# EAGLE design Nixie_Power_Suppy_v2.0.2 (EAGLE 6.5.0)
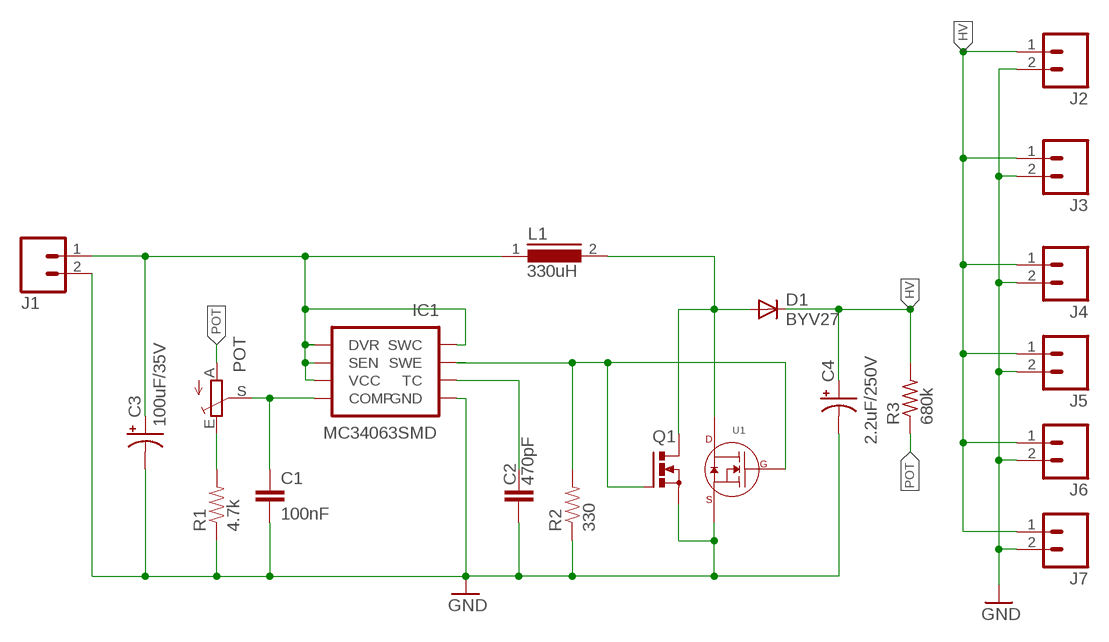
[diagram p0: schematic, sheet 1]

## Parts
C1  100nF  CAP0805  [0805]
C2  470pF  CAP0805  [0805]
C3  100uF/35V  CAP_POLPTH1  [CPOL-RADIAL-100UF-25V]
C4  2.2uF/250V  CAP_POLPTH1  [CPOL-RADIAL-100UF-25V]
D1  BYV27  [SOD57-10]
IC1  MC34063SMD  [SO08]
J1  M02LOCK  [1X02_LOCK]
J2  M02LOCK  [1X02_LOCK]
J3  M02LOCK  [1X02_LOCK]
J4  M02LOCK  [1X02_LOCK]
J5  M02LOCK  [1X02_LOCK]
J6  M02LOCK  [1X02_LOCK]
J7  M02LOCK  [1X02_LOCK]
L1  330uH  DR74  [DR74]
POT  TRIM_EU-CA6V  [CA6V]
Q1  PMOSFET_NTO220BV  [TO220BV]
R1  4.7k  RESISTOR0805-RES  [0805]
R2  330  RESISTOR0805-RES  [0805]
R3  680k  R-US_M1206  [M1206]
U1  MOSFET_N-CHANNEL_SINGLE_TO-252-3  [TO-252-3]

## Nets
GND: C1.2 C2.2 C3.2(-) C4.2(-) IC1.4(GND) J1.2 J2.2 J3.2 J4.2 J5.2 J6.2 J7.2 Q1.S R1.1 R2.1 U1.3(SOURCE)
HV: C4.1(+) D1.C J2.1 J3.1 J4.1 J5.1 J6.1 J7.1 R3.2
N$1: POT.E R1.2
N$2: C1.1 IC1.5(COMP) POT.S
N$3: C3.1(+) IC1.1(SWC) IC1.6(VCC) IC1.7(SEN) IC1.8(DVR) J1.1 L1.1
N$6: D1.A L1.2 Q1.D U1.PAD(DRAIN)
N$8: C2.1 IC1.3(TC)
N$11: IC1.2(SWE) Q1.G R2.2 U1.1(GATE)
POT: POT.A R3.1

## Library data of the parts
C1 C2 = SparkFun-Passives:CAP: Capacitor Standard 0603 ceramic capacitor, and 0.1" leaded capacitor.
C3 C4 = SparkFun-Passives:CAP_POL: Capacitor Polarized These are standard SMD and PTH capacitors. Normally 10uF, 47uF, and 100uF in electrolytic and tantalum varieties. Always verify the external diameter of the through hole cap, it varies with capacity, voltage, and manufacturer. The EIA devices should be standard.
D1 = diode:BYV27: DIODE ultra fast
IC1 = SparkFun-PowerIC:MC34063: Jellybean switching supply controller
J1-J7 = SparkFun-Connectors:M02: Standard 2-pin 0.1" header. Use with - straight break away headers ( PRT-00116) - right angle break away headers (PRT-00553) - swiss pins (PRT-00743) - machine pins (PRT-00117) - female headers (PRT-00115) Molex polarized connector foot print use with: PRT-08233 with associated crimp pins and housings. 2.54_SCREWTERM for use with PRT-10571. 3.5mm Screw Terminal footprints for PRT-08084 5mm Screw Terminal footprints for use with PRT-08432
L1 = inductors:DR74: High Power Density, High Efficiency, Shielded Inductors Source: coiltronics_dr_series.pdf
POT = pot:TRIM_EU-: POTENTIOMETER
Q1 = transistor-power:PMOSFET_N: Power MOSFET N-Channel
R1 R2 = SparkFun-Passives:RESISTOR: Resistor Basic schematic elements and footprints for 0603, 1206, and PTH resistors.
R3 = rcl:R-US_: RESISTOR, American symbol
U1 = PP_Eagle_Part_Discrete_Semi_Conductors:MOSFET_N-CHANNEL_SINGLE: Mosfet - N-Channel - Single

## Board
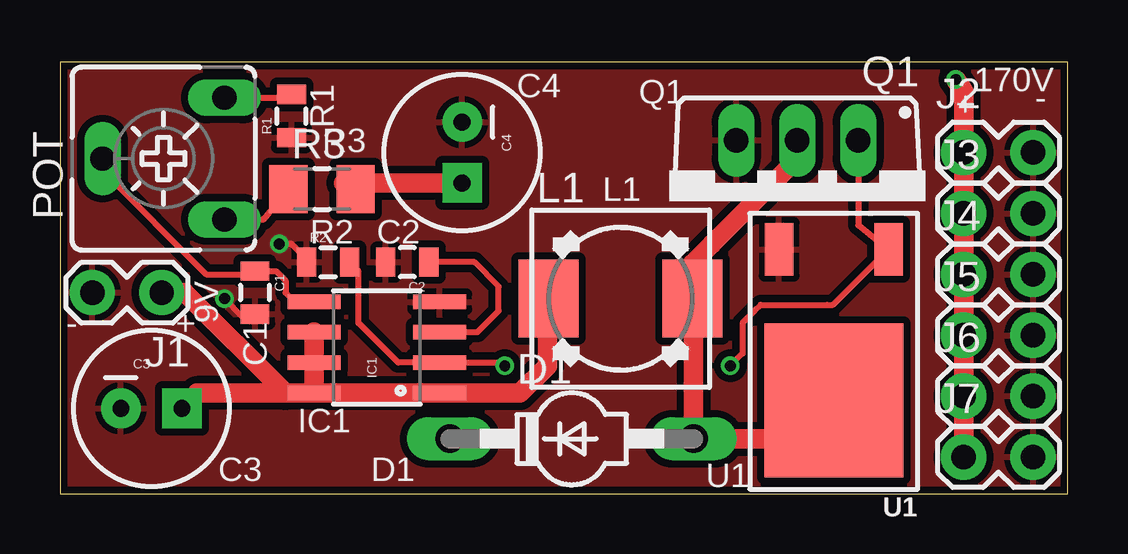
[diagram p1: board, top side]
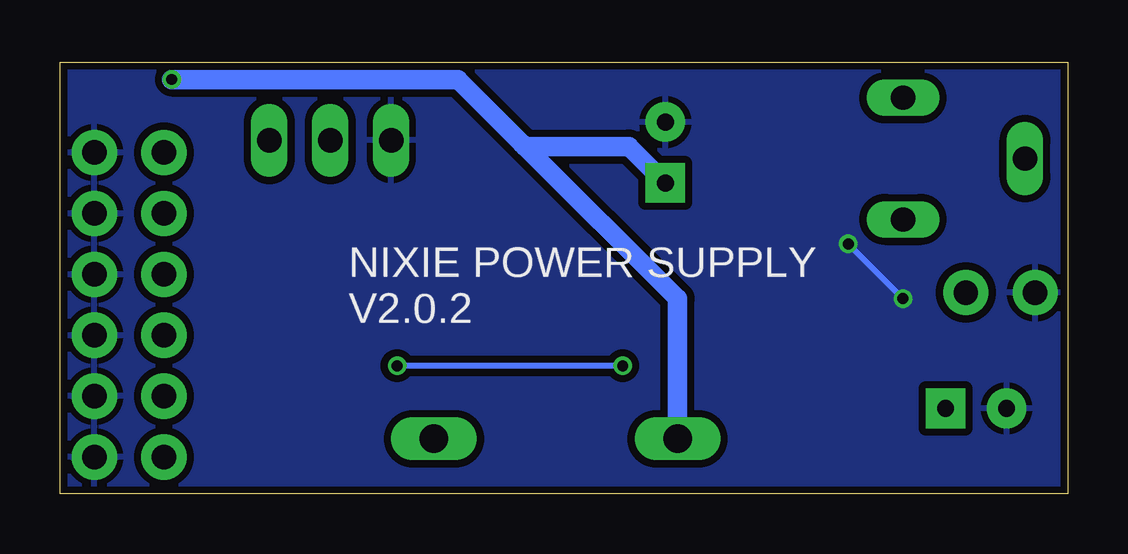
[diagram p2: board, bottom side, seen from below]

Size 42 x 18 mm. Coordinates in mm from the lower left corner, seen from the top.
Outline: 0,0 42,0 42,18 0,18 0,0
Copper layers (1*16): Top 0.035mm / dielectric 1.5mm / Bottom 0.035mm
Design rules "SeeedStudio_2layer_DRU_no_angle_20140221": minimum track width 6mil, minimum drill 12mil, track to track 6mil, track to pad 6mil, pad to pad 6mil, via to via 6mil, smd to smd 0mil, copper to edge 10mil, drill to drill 10mil, minimum pad ring 10mil, minimum via ring 6mil, stop-mask expansion 2mil, vias tented up to drill 100mil, thermal gap 10mil

### Footprints (pad centres in the part's own frame; a part is rotated, then mirrored left to right if it is on the bottom)
0805 = smd 0.8 x 1.2: 1 -0.9,0; 2 0.9,0
CPOL-RADIAL-100UF-25V = drill 0.7 pad 1.651 square: 1 1.27,0 | drill 0.7 pad 1.651: 2 -1.27,0
SOD57-10 = drill 1.194 long: A 5.08,0; C -5.08,0
SO08 = smd 0.61 x 2.21: 1 -1.905,-2.616; 2 -0.635,-2.616; 3 0.635,-2.616; 4 1.905,-2.616; 5 1.905,2.616; 6 0.635,2.616; 7 -0.635,2.616; 8 -1.905,2.616
1X02_LOCK = drill 1.016 pad 1.88: 1 -0.178,0; 2 2.718,0
DR74 = smd 2.5 x 3.25: 1 -3,0; 2 3,0
CA6V = drill 1.016 long: A -2.54,-2.54; E 2.54,-2.54; S 0,2.54
TO220BV = drill 1.016 long: D 0,-2.54; G -2.54,-2.54; S 2.54,-2.54
M1206 = smd 1.6 x 2: 1 -1.4,0; 2 1.4,0
TO-252-3 = smd 1.2 x 2.2: 1 -2.28,-4.6; 3 2.28,-4.6 | smd 5.8 x 6.4: PAD 0,1.7

### Placement (x,y rotation side)
C1  8.13,8.38 270 top
C2  14.48,9.65 180 top
C3  3.81,3.56 0 top
C4  16.76,14.22 270 top
D1  21.34,2.29 0 top
IC1  13.21,6.1 90 top
J1  4.06,8.38 180 top
J2  37.85,14.22 0 top
J3  37.85,11.68 0 top
J4  37.85,9.14 0 top
J5  37.85,6.6 0 top
J6  37.85,4.06 0 top
J7  37.85,1.52 0 top
L1  23.37,8.13 0 top
POT  4.32,13.97 90 top
Q1  30.73,12.19 180 top
R1  9.65,15.75 90 top
R2  11.18,9.65 0 top
R3  10.92,12.7 0 top
U1  32.26,5.59 180 top

### Tracks (layer width: path | path; a pad name or v marks a point on that pad's centre or on a via)
GND  (via drill 0.46)
  Top 0.254: R2.1 10.28,9.79 9.65,10.41 v9.14,10.41 | v6.86,8.13 7.62,7.37 7.74,7.48 C1.2
  Bottom 0.254: v9.14,10.41 v6.86,8.13
  pour Top (isolate 0.305): 0,18.03 41.91,18.03 41.91,0 0,0
  pour Bottom (isolate 0.305): 0,18.03 41.91,18.03 41.91,0 0,0
HV  (via drill 0.46)
  Top 0.813: J7.1 J6.1 J5.1 J4.1 J3.1 J2.1 37.67,16.76 v37.34,17.27 | C4.1 11.82,12.95 R3.2
  Bottom 0.813: v37.34,17.27 25.4,17.27 22.73,14.61 22.61,14.48 | 22.61,14.48 18.29,14.48 C4.1 | D1.C 16.26,8.13 22.61,14.48
N$1
  Top 0.254: POT.E 9.51,16.51 R1.2
N$2
  Top 0.254: POT.S 1.78,13.46 6.1,9.14 7.99,9.14 C1.1 9.01,9.28 9.4,8.89 9.4,8.38 9.91,7.87 10.46,7.87 IC1.5
N$3
  Top 0.813: IC1.6 IC1.7 IC1.8 | IC1.8 9.4,4.19 | 9.4,4.19 5.71,4.19 C3.1 | J1.1 5.21,8.38 9.4,4.19 | IC1.8 IC1.1 17.14,4.19 19.18,4.19 20.32,5.33 20.32,8.08 L1.1
N$6
  Top 0.254: 26.42,8.08 L1.2
  Top 0.813: Q1.D 30.73,13.97 27.18,10.41 26.37,9.6 L1.2 | 26.42,8.08 D1.A 32.26,2.29 U1.PAD
N$8
  Top 0.254: IC1.3 17.4,6.73 18.29,7.62 18.29,8.64 17.27,9.65 C2.1
N$11  (via drill 0.46)
  Top 0.254: R2.2 12.45,9.28 12.45,7.11 14.1,5.46 IC1.2 18.41,5.46 v18.54,5.33 | Q1.G 33.27,11.2 U1.1 32.22,7.87 31.97,7.87 29.21,7.87 28.96,7.62 28.45,7.11 28.45,5.84 v27.94,5.33
  Bottom 0.254: v18.54,5.33 v27.94,5.33
POT
  Top 0.254: POT.A 8.5,11.43 R3.1

### Text on the board
_tplace: C4 | 170V | Q1 | + | - | R1 | R3 | L1 | R2 | C2 | - | + | 9V | C1 | IC1 | C3 | D1 | U1
_bplace: NIXIE POWER SUPPLY / V2.0.2